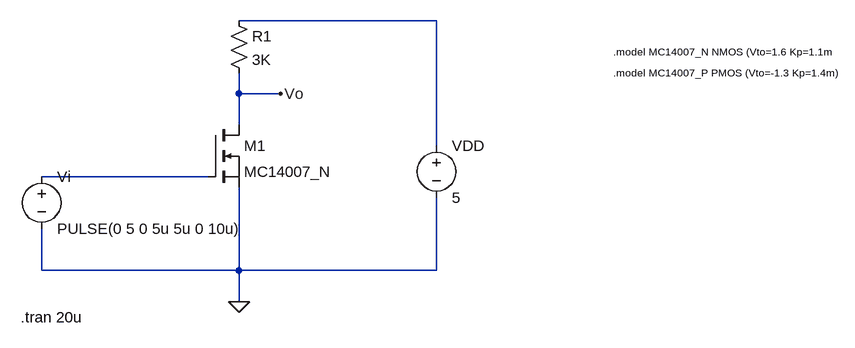
[diagram p0: schematic 1.2.3.asc]
1.2.3.asc, the LTspice schematic file:
Version 4
SHEET 1 880 680
WIRE -128 -64 -432 -64
WIRE -432 48 -432 16
WIRE -368 48 -432 48
WIRE -432 96 -432 48
WIRE -128 128 -128 -64
WIRE -480 176 -736 176
WIRE -736 320 -736 256
WIRE -432 320 -432 192
WIRE -432 320 -736 320
WIRE -128 320 -128 208
WIRE -128 320 -432 320
WIRE -432 368 -432 320
FLAG -432 368 0
FLAG -368 48 Vo
SYMBOL nmos -480 96 R0
SYMATTR InstName M1
SYMATTR Value MC14007_N
SYMBOL voltage -128 112 R0
SYMATTR InstName VDD
SYMATTR Value 5
SYMBOL voltage -736 160 R0
WINDOW 123 0 0 Left 0
WINDOW 39 0 0 Left 0
SYMATTR InstName Vi
SYMATTR Value PULSE(0 5 0 5u 5u 0 10u)
SYMBOL res -448 -80 R0
SYMATTR InstName R1
SYMATTR Value 3K
TEXT 144 -16 Left 1 !.model MC14007_N NMOS (Vto=1.6 Kp=1.1m
TEXT 144 16 Left 1 !.model MC14007_P PMOS (Vto=-1.3 Kp=1.4m)
TEXT -768 392 Left 2 !.tran 20u

The netlist it stands for:
* 1.2.3.asc
M1 Vo N002 0 0 MC14007_N
VDD N001 0 5
Vi N002 0 PULSE(0 5 0 5u 5u 0 10u)
R1 N001 Vo 3K
.model NMOS NMOS
.model PMOS PMOS
.lib standard.mos
.model MC14007_N NMOS (Vto=1.6 Kp=1.1m
.model MC14007_P PMOS (Vto=-1.3 Kp=1.4m)
.tran 20u
.backanno
.end